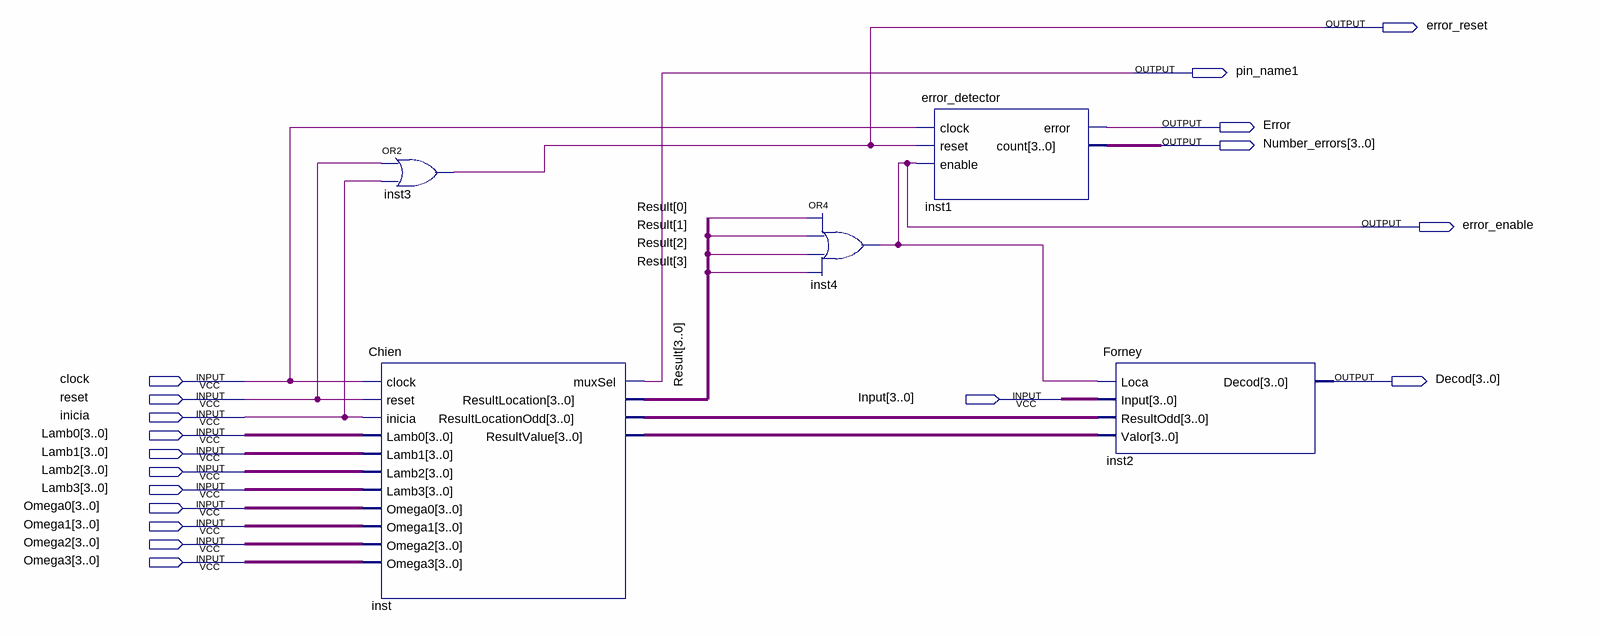
[diagram p0: schematic sheet]
// Quartus schematic ChienForney.bdf as structural Verilog: 5 symbols, 18 pins
module ChienForney (
  input  clock,
  input  reset,
  input  [3:0] Input,
  input  inicia,
  input  [3:0] Lamb0,
  input  [3:0] Lamb1,
  input  [3:0] Lamb2,
  input  [3:0] Lamb3,
  input  [3:0] Omega0,
  input  [3:0] Omega1,
  input  [3:0] Omega2,
  input  [3:0] Omega3,
  output error_reset,
  output pin_name1,
  output Error,
  output [3:0] Number_errors,
  output error_enable,
  output [3:0] Decod
);

  wire [3:0] inst_resultlocationodd, inst_resultvalue, Result;

  or inst3 (error_reset, reset, inicia);
  Chien inst (
    .clock(clock), .reset(reset), .inicia(inicia), .Lamb0(Lamb0), .Lamb1(Lamb1), .Lamb2(Lamb2),
    .Lamb3(Lamb3), .Omega0(Omega0), .Omega1(Omega1), .Omega2(Omega2), .Omega3(Omega3), .muxSel(pin_name1),
    .ResultLocation(Result), .ResultLocationOdd(inst_resultlocationodd), .ResultValue(inst_resultvalue));
  or inst4 (error_enable, Result[0], Result[1], Result[2], Result[3]);
  error_detector inst1 (
    .clock(clock), .reset(error_reset), .enable(error_enable), .error(Error), .count(Number_errors));
  Forney inst2 (
    .Loca(error_enable), .Input(Input), .ResultOdd(inst_resultlocationodd), .Valor(inst_resultvalue),
    .Decod(Decod));
endmodule
